# Altium project Sensor_Array.PrjPcb
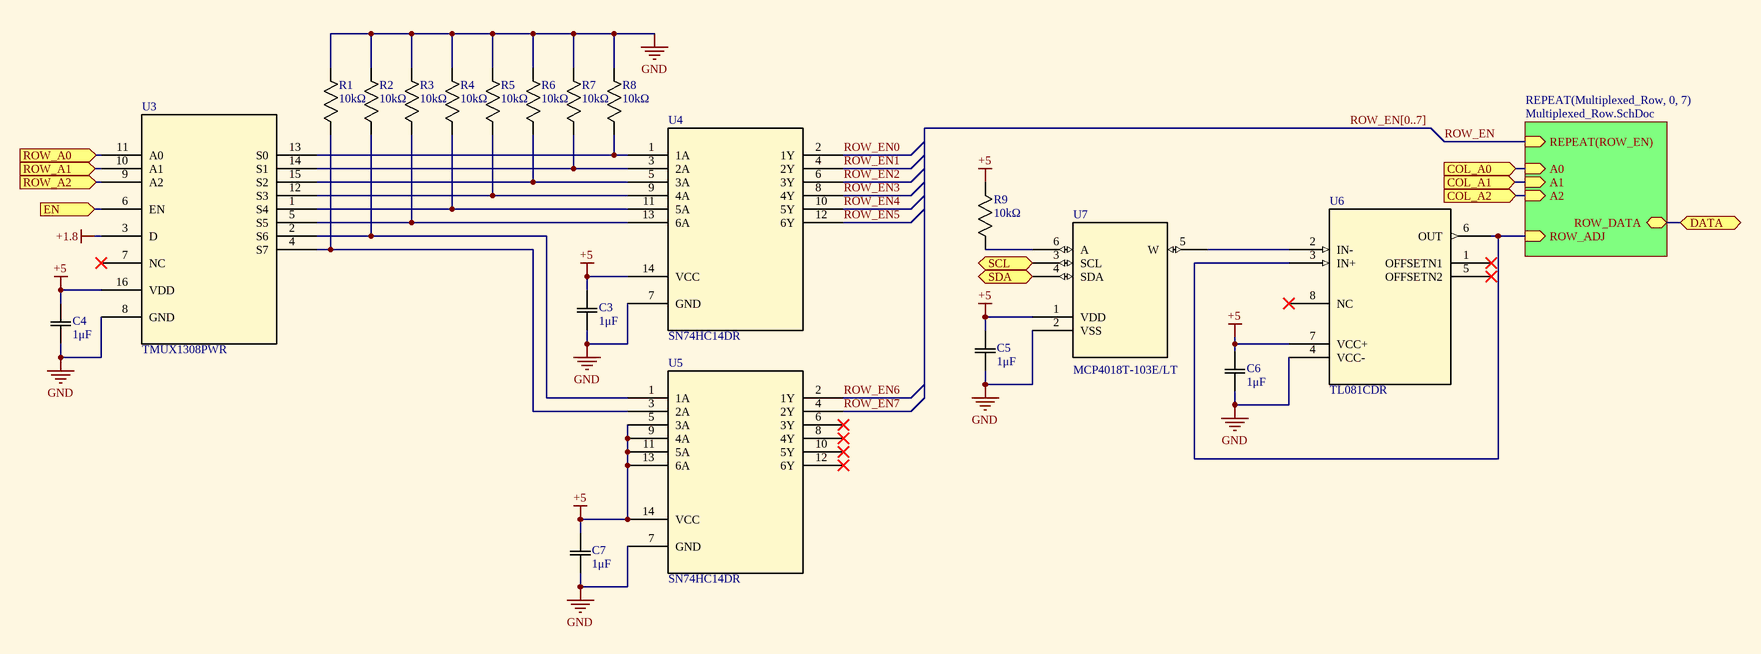
[diagram p0: TOP.SchDoc]
3 sheets, 163 parts. Net scope: hierarchical (ports join the sheet entries above them; power ports are global).
Board file: Sensor_Array.PcbDoc
Sheets:
  TOP.SchDoc
    Multiplexed_Row0 = Multiplexed_Row.SchDoc
      Hall_Latch0 = Hall_Latch.SchDoc
      Hall_Latch1 = Hall_Latch.SchDoc
      Hall_Latch2 = Hall_Latch.SchDoc
      Hall_Latch3 = Hall_Latch.SchDoc
      Hall_Latch4 = Hall_Latch.SchDoc
      Hall_Latch5 = Hall_Latch.SchDoc
      Hall_Latch6 = Hall_Latch.SchDoc
      Hall_Latch7 = Hall_Latch.SchDoc
    Multiplexed_Row1 = Multiplexed_Row.SchDoc
      Hall_Latch0 = Hall_Latch.SchDoc
      Hall_Latch1 = Hall_Latch.SchDoc
      Hall_Latch2 = Hall_Latch.SchDoc
      Hall_Latch3 = Hall_Latch.SchDoc
      Hall_Latch4 = Hall_Latch.SchDoc
      Hall_Latch5 = Hall_Latch.SchDoc
      Hall_Latch6 = Hall_Latch.SchDoc
      Hall_Latch7 = Hall_Latch.SchDoc
    Multiplexed_Row2 = Multiplexed_Row.SchDoc
      Hall_Latch0 = Hall_Latch.SchDoc
      Hall_Latch1 = Hall_Latch.SchDoc
      Hall_Latch2 = Hall_Latch.SchDoc
      Hall_Latch3 = Hall_Latch.SchDoc
      Hall_Latch4 = Hall_Latch.SchDoc
      Hall_Latch5 = Hall_Latch.SchDoc
      Hall_Latch6 = Hall_Latch.SchDoc
      Hall_Latch7 = Hall_Latch.SchDoc
    Multiplexed_Row3 = Multiplexed_Row.SchDoc
      Hall_Latch0 = Hall_Latch.SchDoc
      Hall_Latch1 = Hall_Latch.SchDoc
      Hall_Latch2 = Hall_Latch.SchDoc
      Hall_Latch3 = Hall_Latch.SchDoc
      Hall_Latch4 = Hall_Latch.SchDoc
      Hall_Latch5 = Hall_Latch.SchDoc
      Hall_Latch6 = Hall_Latch.SchDoc
      Hall_Latch7 = Hall_Latch.SchDoc
    Multiplexed_Row4 = Multiplexed_Row.SchDoc
      Hall_Latch0 = Hall_Latch.SchDoc
      Hall_Latch1 = Hall_Latch.SchDoc
      Hall_Latch2 = Hall_Latch.SchDoc
      Hall_Latch3 = Hall_Latch.SchDoc
      Hall_Latch4 = Hall_Latch.SchDoc
      Hall_Latch5 = Hall_Latch.SchDoc
      Hall_Latch6 = Hall_Latch.SchDoc
      Hall_Latch7 = Hall_Latch.SchDoc
    Multiplexed_Row5 = Multiplexed_Row.SchDoc
      Hall_Latch0 = Hall_Latch.SchDoc
      Hall_Latch1 = Hall_Latch.SchDoc
      Hall_Latch2 = Hall_Latch.SchDoc
      Hall_Latch3 = Hall_Latch.SchDoc
      Hall_Latch4 = Hall_Latch.SchDoc
      Hall_Latch5 = Hall_Latch.SchDoc
      Hall_Latch6 = Hall_Latch.SchDoc
      Hall_Latch7 = Hall_Latch.SchDoc
    Multiplexed_Row6 = Multiplexed_Row.SchDoc
      Hall_Latch0 = Hall_Latch.SchDoc
      Hall_Latch1 = Hall_Latch.SchDoc
      Hall_Latch2 = Hall_Latch.SchDoc
      Hall_Latch3 = Hall_Latch.SchDoc
      Hall_Latch4 = Hall_Latch.SchDoc
      Hall_Latch5 = Hall_Latch.SchDoc
      Hall_Latch6 = Hall_Latch.SchDoc
      Hall_Latch7 = Hall_Latch.SchDoc
    Multiplexed_Row7 = Multiplexed_Row.SchDoc
      Hall_Latch0 = Hall_Latch.SchDoc
      Hall_Latch1 = Hall_Latch.SchDoc
      Hall_Latch2 = Hall_Latch.SchDoc
      Hall_Latch3 = Hall_Latch.SchDoc
      Hall_Latch4 = Hall_Latch.SchDoc
      Hall_Latch5 = Hall_Latch.SchDoc
      Hall_Latch6 = Hall_Latch.SchDoc
      Hall_Latch7 = Hall_Latch.SchDoc

## Sheet TOP.SchDoc: Chess Board Sensor Array
size A3; DrawnBy: Brandon Skarka; Revision: 0; SheetNumber: 1; SheetTotal: 3

### Parts
C3  1μF  [CAP_CL10_SAM]
C4  1μF  [CAP_CL10_SAM]
C5  1μF  [CAP_CL10_SAM]
C6  1μF  [CAP_CL10_SAM]
C7  1μF  [CAP_CL10_SAM]
R1  10kΩ  [RES_RC0603_YAG]
R2  10kΩ  [RES_RC0603_YAG]
R3  10kΩ  [RES_RC0603_YAG]
R4  10kΩ  [RES_RC0603_YAG]
R5  10kΩ  [RES_RC0603_YAG]
R6  10kΩ  [RES_RC0603_YAG]
R7  10kΩ  [RES_RC0603_YAG]
R8  10kΩ  [RES_RC0603_YAG]
R9  10kΩ  [RES_RC0603_YAG]
U3  TMUX1308PWR  [TSSOP16_PW_TEX]
U4  SN74HC14DR  [D14]
U5  SN74HC14DR  [D14]
U6  TL081CDR  [D8]
U7  MCP4018T-103E/LT  [SC70-6_MC_MCH]

### Sub-sheets
REPEAT(Multiplexed_Row, 0, 7) = Multiplexed_Row.SchDoc: A0 (in), A1 (in), A2 (in), ROW_ADJ (in), REPEAT(ROW_EN) (in), ROW_DATA (bidir)

### Ports
COL_A0 (in), COL_A1 (in), COL_A2 (in), DATA (bidir), EN (in), ROW_A0 (in), ROW_A1 (in), ROW_A2 (in), SCL (bidir), SDA (bidir)

### Nets
+1.8: U3.3(D)
+5: C3.2 C4.2 C5.2 C6.2 C7.2 R9.2 U3.16(VDD) U4.14(VCC) U5.5(3A) U5.9(4A) U5.11(5A) U5.13(6A) U5.14(VCC) U6.7(VCC+) U7.1(VDD)
GND: C3.1 C4.1 C5.1 C6.1 C7.1 R1.2 R2.2 R3.2 R4.2 R5.2 R6.2 R7.2 R8.2 U3.8(GND) U4.7(GND) U5.7(GND) U6.4(VCC-) U7.2(VSS)
ROW_EN: sheet REPEAT(Multiplexed_Row, 0, 7)/REPEAT(ROW_EN)
ROW_EN0: U4.2(1Y)
ROW_EN1: U4.4(2Y)
ROW_EN2: U4.6(3Y)
ROW_EN3: U4.8(4Y)
ROW_EN4: U4.10(5Y)
ROW_EN5: U4.12(6Y)
ROW_EN6: U5.2(1Y)
ROW_EN7: U5.4(2Y)
NetR1_1: R1.1 U3.4(S7) U5.3(2A)
NetR2_1: R2.1 U3.2(S6) U5.1(1A)
NetR3_1: R3.1 U3.5(S5) U4.13(6A)
NetR4_1: R4.1 U3.1(S4) U4.11(5A)
NetR5_1: R5.1 U3.12(S3) U4.9(4A)
NetR6_1: R6.1 U3.15(S2) U4.5(3A)
NetR7_1: R7.1 U3.14(S1) U4.3(2A)
NetR8_1: R8.1 U3.13(S0) U4.1(1A)
NetR9_1: R9.1 U7.6(A)
NetU1_1_3: port DATA, sheet REPEAT(Multiplexed_Row, 0, 7)/ROW_DATA
NetU1_1_9: port COL_A2, sheet REPEAT(Multiplexed_Row, 0, 7)/A2
NetU1_1_10: port COL_A1, sheet REPEAT(Multiplexed_Row, 0, 7)/A1
NetU1_1_11: port COL_A0, sheet REPEAT(Multiplexed_Row, 0, 7)/A0
NetU2_1_3: U6.3(IN+) U6.6(OUT) ; sheet REPEAT(Multiplexed_Row, 0, 7)/ROW_ADJ
NetU3_6: U3.6(EN) ; port EN
NetU3_9: U3.9(A2) ; port ROW_A2
NetU3_10: U3.10(A1) ; port ROW_A1
NetU3_11: U3.11(A0) ; port ROW_A0
NetU6_2: U6.2(IN-) U7.5(W)
NetU7_3: U7.3(SCL) ; port SCL
NetU7_4: U7.4(SDA) ; port SDA

Not connected (* = marked no-connect by the designer): U3 7(NC)*; U5 6(3Y)* 8(4Y)* 10(5Y)* 12(6Y)*; U6 1(OFFSETN1)* 5(OFFSETN2)* 8(NC)*

### Buses and harness runs
bus ROW_EN[0..7]

### Library data of the parts
C3-C7 = CL10B104KB8NNWC: No Description Available; Mfr_Name: Samsung; Digi-Key_Part_Number_3: 1276-1935-6-ND; Digi-Key_Part_Number_2: 1276-1935-1-ND; Digi-Key_Part_Number_1: 1276-1935-2-ND; Supplier 1: Digi-Key; Supplier Part Number 1: 1276-1935-6-ND; Supplier 2: Mouser; Supplier Part Number 2: 187-CL10B104KB8NNWC
R1-R9 = RC0603FR-7W10KL: No Description Available; Mfr_Name: Yageo; Copyright: Copyright (C) 2023 Ultra Librarian. All rights reserved.; Manufacturer_Part_Number: RC0603FR-7W10KL; RefDes: RefDes; Type: DEV; Supplier 1: Mouser; Supplier Part Number 1: 603-RC0603FR-7W10KL; Supplier 2: Digi-Key; Supplier Part Number 2: 13-RC0603FR-7W10KLCT-ND
U3 = TMUX1308PWR: No Description Available; Mfr_Name: Texas Instruments; RefDes: RefDes; Type: Type; Supplier 1: Mouser; Supplier Part Number 1: 595-TMUX1308PWR; Supplier 2: Digi-Key; Supplier Part Number 2: 296-TMUX1308PWRCT-ND
U4 U5 = SN74HC14DR: No Description Available; Mfr_Name: Texas Instruments; Digi-Key_Part_Number_4: 2156-SN74HC14DR-ND; Digi-Key_Part_Number_3: 296-1194-6-ND; Digi-Key_Part_Number_1: 296-1194-1-ND; Digi-Key_Part_Number_2: 296-1194-2-ND; RefDes: RefDes; Type: Type; Supplier 1: Mouser; Supplier Part Number 1: 595-SN74HC14DR; Supplier 2: Digi-Key; Supplier Part Number 2: 296-1194-1-ND
U6 = TL081CDR: No Description Available; Mfr_Name: Texas Instruments; Copyright: Copyright (C) 2023 Ultra Librarian. All rights reserved.; Manufacturer_Part_Number: TL081CDR; RefDes: RefDes; Type: DEV; Supplier 1: Mouser; Supplier Part Number 1: 595-TL081CDR; Supplier 2: Digi-Key; Supplier Part Number 2: 296-15001-1-ND
U7 = MCP4018T-103ELT: No Description Available; Mfr_Name: Microchip; Copyright: Copyright (C) 2023 Ultra Librarian. All rights reserved.; Manufacturer_Part_Number: MCP4018T-103E/LT; RefDes: RefDes; Type: DEV; Supplier 1: Mouser; Supplier Part Number 1: 579-MCP4018T103E/LT; Supplier 2: Digi-Key; Supplier Part Number 2: MCP4018T-103E/LTCT-ND

## Sheet Multiplexed_Row.SchDoc: Multiplexed Row
size A4; DrawnBy: Brandon Skarka; Revision: 0; SheetNumber: 2; SheetTotal: 3
Used 8 times, as channels Multiplexed_Row0, Multiplexed_Row1, Multiplexed_Row2, Multiplexed_Row3, Multiplexed_Row4, Multiplexed_Row5, Multiplexed_Row6, Multiplexed_Row7. Parts and nets are listed once, with the designators drawn on the sheet.
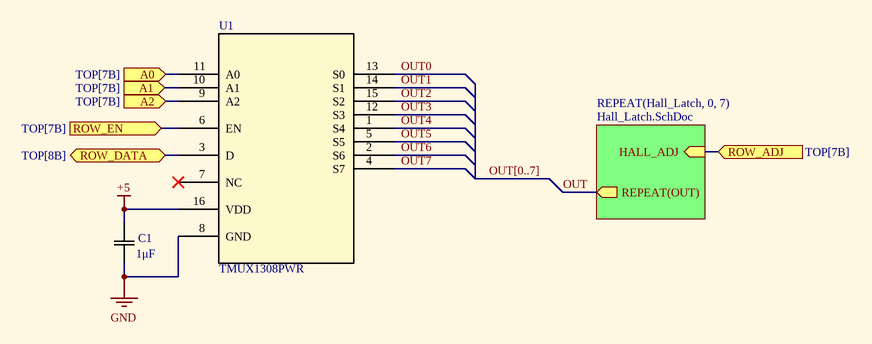
[diagram p1: Multiplexed_Row.SchDoc]

### Parts
C1  1μF  [CAP_CL10_SAM]
U1  TMUX1308PWR  [TSSOP16_PW_TEX]

### Sub-sheets
REPEAT(Hall_Latch, 0, 7) = Hall_Latch.SchDoc: REPEAT(OUT) (out), HALL_ADJ (in)

### Ports
A0 (in, see TOP[7B]), A1 (in, see TOP[7B]), A2 (in, see TOP[7B]), ROW_ADJ (in, see TOP[7B]), ROW_DATA (bidir, see TOP[8B]), ROW_EN (in, see TOP[7B])

### Nets
+5: C1.2 U1.16(VDD)
GND: C1.1 U1.8(GND)
A0: U1.11(A0) ; port A0
A1: U1.10(A1) ; port A1
A2: U1.9(A2) ; port A2
OUT: sheet REPEAT(Hall_Latch, 0, 7)/REPEAT(OUT)
OUT0: U1.13(S0)
OUT1: U1.14(S1)
OUT2: U1.15(S2)
OUT3: U1.12(S3)
OUT4: U1.1(S4)
OUT5: U1.5(S5)
OUT6: U1.2(S6)
OUT7: U1.4(S7)
ROW_ADJ: port ROW_ADJ, sheet REPEAT(Hall_Latch, 0, 7)/HALL_ADJ
ROW_DATA: U1.3(D) ; port ROW_DATA
ROW_EN: U1.6(EN) ; port ROW_EN

Not connected (* = marked no-connect by the designer): U1 7(NC)*

### Channels
Multiplexed_Row0: designators end in _1; ports A0=NetU1_1_11 A1=NetU1_1_10 A2=NetU1_1_9 ROW_ADJ=NetU2_1_3 ROW_DATA=NetU1_1_3 ROW_EN=ROW_EN0
Multiplexed_Row1: designators end in _2; ports A0=NetU1_1_11 A1=NetU1_1_10 A2=NetU1_1_9 ROW_ADJ=NetU2_1_3 ROW_DATA=NetU1_1_3 ROW_EN=ROW_EN1
Multiplexed_Row2: designators end in _3; ports A0=NetU1_1_11 A1=NetU1_1_10 A2=NetU1_1_9 ROW_ADJ=NetU2_1_3 ROW_DATA=NetU1_1_3 ROW_EN=ROW_EN2
Multiplexed_Row3: designators end in _4; ports A0=NetU1_1_11 A1=NetU1_1_10 A2=NetU1_1_9 ROW_ADJ=NetU2_1_3 ROW_DATA=NetU1_1_3 ROW_EN=ROW_EN3
Multiplexed_Row4: designators end in _5; ports A0=NetU1_1_11 A1=NetU1_1_10 A2=NetU1_1_9 ROW_ADJ=NetU2_1_3 ROW_DATA=NetU1_1_3 ROW_EN=ROW_EN4
Multiplexed_Row5: designators end in _6; ports A0=NetU1_1_11 A1=NetU1_1_10 A2=NetU1_1_9 ROW_ADJ=NetU2_1_3 ROW_DATA=NetU1_1_3 ROW_EN=ROW_EN5
Multiplexed_Row6: designators end in _7; ports A0=NetU1_1_11 A1=NetU1_1_10 A2=NetU1_1_9 ROW_ADJ=NetU2_1_3 ROW_DATA=NetU1_1_3 ROW_EN=ROW_EN6
Multiplexed_Row7: designators end in _8; ports A0=NetU1_1_11 A1=NetU1_1_10 A2=NetU1_1_9 ROW_ADJ=NetU2_1_3 ROW_DATA=NetU1_1_3 ROW_EN=ROW_EN7

### Buses and harness runs
bus OUT[0..7]

### Library data of the parts
C1 = CL10B104KB8NNWC: as C3 on sheet TOP; Digi-Key_Part_Number_3: 1276-1935-6-ND; Digi-Key_Part_Number_2: 1276-1935-1-ND; Digi-Key_Part_Number_1: 1276-1935-2-ND; Supplier 1: Digi-Key; Supplier Part Number 1: 1276-1935-6-ND; Supplier 2: Mouser; Supplier Part Number 2: 187-CL10B104KB8NNWC
U1 = TMUX1308PWR: as U3 on sheet TOP; RefDes: RefDes; Type: Type; Supplier 1: Mouser; Supplier Part Number 1: 595-TMUX1308PWR; Supplier 2: Digi-Key; Supplier Part Number 2: 296-TMUX1308PWRCT-ND

## Sheet Hall_Latch.SchDoc: Hall Sensor
size A4; DrawnBy: Brandon Skarka; Revision: 0; SheetNumber: 2; SheetTotal: 2
Used 64 times, as channels Multiplexed_Row0/Hall_Latch0, Multiplexed_Row0/Hall_Latch1, Multiplexed_Row0/Hall_Latch2, Multiplexed_Row0/Hall_Latch3, Multiplexed_Row0/Hall_Latch4, Multiplexed_Row0/Hall_Latch5, Multiplexed_Row0/Hall_Latch6, Multiplexed_Row0/Hall_Latch7, Multiplexed_Row1/Hall_Latch0, Multiplexed_Row1/Hall_Latch1, Multiplexed_Row1/Hall_Latch2, Multiplexed_Row1/Hall_Latch3, Multiplexed_Row1/Hall_Latch4, Multiplexed_Row1/Hall_Latch5, Multiplexed_Row1/Hall_Latch6, Multiplexed_Row1/Hall_Latch7, Multiplexed_Row2/Hall_Latch0, Multiplexed_Row2/Hall_Latch1, Multiplexed_Row2/Hall_Latch2, Multiplexed_Row2/Hall_Latch3, Multiplexed_Row2/Hall_Latch4, Multiplexed_Row2/Hall_Latch5, Multiplexed_Row2/Hall_Latch6, Multiplexed_Row2/Hall_Latch7, Multiplexed_Row3/Hall_Latch0, Multiplexed_Row3/Hall_Latch1, Multiplexed_Row3/Hall_Latch2, Multiplexed_Row3/Hall_Latch3, Multiplexed_Row3/Hall_Latch4, Multiplexed_Row3/Hall_Latch5, Multiplexed_Row3/Hall_Latch6, Multiplexed_Row3/Hall_Latch7, Multiplexed_Row4/Hall_Latch0, Multiplexed_Row4/Hall_Latch1, Multiplexed_Row4/Hall_Latch2, Multiplexed_Row4/Hall_Latch3, Multiplexed_Row4/Hall_Latch4, Multiplexed_Row4/Hall_Latch5, Multiplexed_Row4/Hall_Latch6, Multiplexed_Row4/Hall_Latch7, Multiplexed_Row5/Hall_Latch0, Multiplexed_Row5/Hall_Latch1, Multiplexed_Row5/Hall_Latch2, Multiplexed_Row5/Hall_Latch3, Multiplexed_Row5/Hall_Latch4, Multiplexed_Row5/Hall_Latch5, Multiplexed_Row5/Hall_Latch6, Multiplexed_Row5/Hall_Latch7, Multiplexed_Row6/Hall_Latch0, Multiplexed_Row6/Hall_Latch1, Multiplexed_Row6/Hall_Latch2, Multiplexed_Row6/Hall_Latch3, Multiplexed_Row6/Hall_Latch4, Multiplexed_Row6/Hall_Latch5, Multiplexed_Row6/Hall_Latch6, Multiplexed_Row6/Hall_Latch7, Multiplexed_Row7/Hall_Latch0, Multiplexed_Row7/Hall_Latch1, Multiplexed_Row7/Hall_Latch2, Multiplexed_Row7/Hall_Latch3, Multiplexed_Row7/Hall_Latch4, Multiplexed_Row7/Hall_Latch5, Multiplexed_Row7/Hall_Latch6, Multiplexed_Row7/Hall_Latch7. Parts and nets are listed once, with the designators drawn on the sheet.
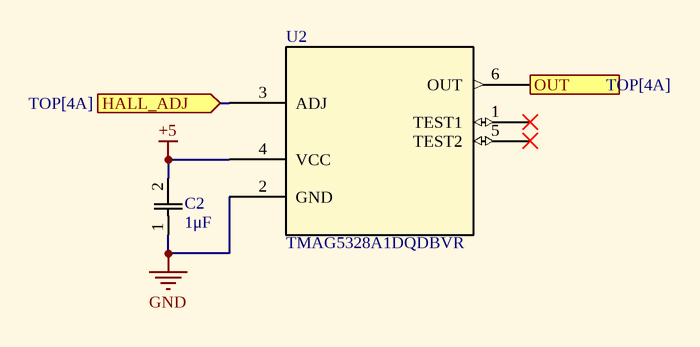
[diagram p2: Hall_Latch.SchDoc]

### Parts
C2  1μF  [CAP_CL10_SAM]
U2  TMAG5328A1DQDBVR  [SOT23_DBV_TEX]

### Ports
HALL_ADJ (in, see TOP[4A]), OUT (out, see TOP[4A])

### Nets
+5: C2.2 U2.4(VCC)
GND: C2.1 U2.2(GND)
HALL_ADJ: U2.3(ADJ) ; port HALL_ADJ
OUT: U2.6(OUT) ; port OUT

Not connected (* = marked no-connect by the designer): U2 1(TEST1)* 5(TEST2)*

### Channels
Multiplexed_Row0/Hall_Latch0: designators end in _1; ports HALL_ADJ=NetU2_1_3 OUT=OUT0_Multiplexed_Row0
Multiplexed_Row0/Hall_Latch1: designators end in _2; ports HALL_ADJ=NetU2_1_3 OUT=OUT1_Multiplexed_Row0
Multiplexed_Row0/Hall_Latch2: designators end in _3; ports HALL_ADJ=NetU2_1_3 OUT=OUT2_Multiplexed_Row0
Multiplexed_Row0/Hall_Latch3: designators end in _4; ports HALL_ADJ=NetU2_1_3 OUT=OUT3_Multiplexed_Row0
Multiplexed_Row0/Hall_Latch4: designators end in _5; ports HALL_ADJ=NetU2_1_3 OUT=OUT4_Multiplexed_Row0
Multiplexed_Row0/Hall_Latch5: designators end in _6; ports HALL_ADJ=NetU2_1_3 OUT=OUT5_Multiplexed_Row0
Multiplexed_Row0/Hall_Latch6: designators end in _7; ports HALL_ADJ=NetU2_1_3 OUT=OUT6_Multiplexed_Row0
Multiplexed_Row0/Hall_Latch7: designators end in _8; ports HALL_ADJ=NetU2_1_3 OUT=OUT7_Multiplexed_Row0
Multiplexed_Row1/Hall_Latch0: designators end in _9; ports HALL_ADJ=NetU2_1_3 OUT=OUT0_Multiplexed_Row1
Multiplexed_Row1/Hall_Latch1: designators end in _10; ports HALL_ADJ=NetU2_1_3 OUT=OUT1_Multiplexed_Row1
Multiplexed_Row1/Hall_Latch2: designators end in _11; ports HALL_ADJ=NetU2_1_3 OUT=OUT2_Multiplexed_Row1
Multiplexed_Row1/Hall_Latch3: designators end in _12; ports HALL_ADJ=NetU2_1_3 OUT=OUT3_Multiplexed_Row1
Multiplexed_Row1/Hall_Latch4: designators end in _13; ports HALL_ADJ=NetU2_1_3 OUT=OUT4_Multiplexed_Row1
Multiplexed_Row1/Hall_Latch5: designators end in _14; ports HALL_ADJ=NetU2_1_3 OUT=OUT5_Multiplexed_Row1
Multiplexed_Row1/Hall_Latch6: designators end in _15; ports HALL_ADJ=NetU2_1_3 OUT=OUT6_Multiplexed_Row1
Multiplexed_Row1/Hall_Latch7: designators end in _16; ports HALL_ADJ=NetU2_1_3 OUT=OUT7_Multiplexed_Row1
Multiplexed_Row2/Hall_Latch0: designators end in _17; ports HALL_ADJ=NetU2_1_3 OUT=OUT0_Multiplexed_Row2
Multiplexed_Row2/Hall_Latch1: designators end in _18; ports HALL_ADJ=NetU2_1_3 OUT=OUT1_Multiplexed_Row2
Multiplexed_Row2/Hall_Latch2: designators end in _19; ports HALL_ADJ=NetU2_1_3 OUT=OUT2_Multiplexed_Row2
Multiplexed_Row2/Hall_Latch3: designators end in _20; ports HALL_ADJ=NetU2_1_3 OUT=OUT3_Multiplexed_Row2
Multiplexed_Row2/Hall_Latch4: designators end in _21; ports HALL_ADJ=NetU2_1_3 OUT=OUT4_Multiplexed_Row2
Multiplexed_Row2/Hall_Latch5: designators end in _22; ports HALL_ADJ=NetU2_1_3 OUT=OUT5_Multiplexed_Row2
Multiplexed_Row2/Hall_Latch6: designators end in _23; ports HALL_ADJ=NetU2_1_3 OUT=OUT6_Multiplexed_Row2
Multiplexed_Row2/Hall_Latch7: designators end in _24; ports HALL_ADJ=NetU2_1_3 OUT=OUT7_Multiplexed_Row2
Multiplexed_Row3/Hall_Latch0: designators end in _25; ports HALL_ADJ=NetU2_1_3 OUT=OUT0_Multiplexed_Row3
Multiplexed_Row3/Hall_Latch1: designators end in _26; ports HALL_ADJ=NetU2_1_3 OUT=OUT1_Multiplexed_Row3
Multiplexed_Row3/Hall_Latch2: designators end in _27; ports HALL_ADJ=NetU2_1_3 OUT=OUT2_Multiplexed_Row3
Multiplexed_Row3/Hall_Latch3: designators end in _28; ports HALL_ADJ=NetU2_1_3 OUT=OUT3_Multiplexed_Row3
Multiplexed_Row3/Hall_Latch4: designators end in _29; ports HALL_ADJ=NetU2_1_3 OUT=OUT4_Multiplexed_Row3
Multiplexed_Row3/Hall_Latch5: designators end in _30; ports HALL_ADJ=NetU2_1_3 OUT=OUT5_Multiplexed_Row3
Multiplexed_Row3/Hall_Latch6: designators end in _31; ports HALL_ADJ=NetU2_1_3 OUT=OUT6_Multiplexed_Row3
Multiplexed_Row3/Hall_Latch7: designators end in _32; ports HALL_ADJ=NetU2_1_3 OUT=OUT7_Multiplexed_Row3
Multiplexed_Row4/Hall_Latch0: designators end in _33; ports HALL_ADJ=NetU2_1_3 OUT=OUT0_Multiplexed_Row4
Multiplexed_Row4/Hall_Latch1: designators end in _34; ports HALL_ADJ=NetU2_1_3 OUT=OUT1_Multiplexed_Row4
Multiplexed_Row4/Hall_Latch2: designators end in _35; ports HALL_ADJ=NetU2_1_3 OUT=OUT2_Multiplexed_Row4
Multiplexed_Row4/Hall_Latch3: designators end in _36; ports HALL_ADJ=NetU2_1_3 OUT=OUT3_Multiplexed_Row4
Multiplexed_Row4/Hall_Latch4: designators end in _37; ports HALL_ADJ=NetU2_1_3 OUT=OUT4_Multiplexed_Row4
Multiplexed_Row4/Hall_Latch5: designators end in _38; ports HALL_ADJ=NetU2_1_3 OUT=OUT5_Multiplexed_Row4
Multiplexed_Row4/Hall_Latch6: designators end in _39; ports HALL_ADJ=NetU2_1_3 OUT=OUT6_Multiplexed_Row4
Multiplexed_Row4/Hall_Latch7: designators end in _40; ports HALL_ADJ=NetU2_1_3 OUT=OUT7_Multiplexed_Row4
Multiplexed_Row5/Hall_Latch0: designators end in _41; ports HALL_ADJ=NetU2_1_3 OUT=OUT0_Multiplexed_Row5
Multiplexed_Row5/Hall_Latch1: designators end in _42; ports HALL_ADJ=NetU2_1_3 OUT=OUT1_Multiplexed_Row5
Multiplexed_Row5/Hall_Latch2: designators end in _43; ports HALL_ADJ=NetU2_1_3 OUT=OUT2_Multiplexed_Row5
Multiplexed_Row5/Hall_Latch3: designators end in _44; ports HALL_ADJ=NetU2_1_3 OUT=OUT3_Multiplexed_Row5
Multiplexed_Row5/Hall_Latch4: designators end in _45; ports HALL_ADJ=NetU2_1_3 OUT=OUT4_Multiplexed_Row5
Multiplexed_Row5/Hall_Latch5: designators end in _46; ports HALL_ADJ=NetU2_1_3 OUT=OUT5_Multiplexed_Row5
Multiplexed_Row5/Hall_Latch6: designators end in _47; ports HALL_ADJ=NetU2_1_3 OUT=OUT6_Multiplexed_Row5
Multiplexed_Row5/Hall_Latch7: designators end in _48; ports HALL_ADJ=NetU2_1_3 OUT=OUT7_Multiplexed_Row5
Multiplexed_Row6/Hall_Latch0: designators end in _49; ports HALL_ADJ=NetU2_1_3 OUT=OUT0_Multiplexed_Row6
Multiplexed_Row6/Hall_Latch1: designators end in _50; ports HALL_ADJ=NetU2_1_3 OUT=OUT1_Multiplexed_Row6
Multiplexed_Row6/Hall_Latch2: designators end in _51; ports HALL_ADJ=NetU2_1_3 OUT=OUT2_Multiplexed_Row6
Multiplexed_Row6/Hall_Latch3: designators end in _52; ports HALL_ADJ=NetU2_1_3 OUT=OUT3_Multiplexed_Row6
Multiplexed_Row6/Hall_Latch4: designators end in _53; ports HALL_ADJ=NetU2_1_3 OUT=OUT4_Multiplexed_Row6
Multiplexed_Row6/Hall_Latch5: designators end in _54; ports HALL_ADJ=NetU2_1_3 OUT=OUT5_Multiplexed_Row6
Multiplexed_Row6/Hall_Latch6: designators end in _55; ports HALL_ADJ=NetU2_1_3 OUT=OUT6_Multiplexed_Row6
Multiplexed_Row6/Hall_Latch7: designators end in _56; ports HALL_ADJ=NetU2_1_3 OUT=OUT7_Multiplexed_Row6
Multiplexed_Row7/Hall_Latch0: designators end in _57; ports HALL_ADJ=NetU2_1_3 OUT=OUT0_Multiplexed_Row7
Multiplexed_Row7/Hall_Latch1: designators end in _58; ports HALL_ADJ=NetU2_1_3 OUT=OUT1_Multiplexed_Row7
Multiplexed_Row7/Hall_Latch2: designators end in _59; ports HALL_ADJ=NetU2_1_3 OUT=OUT2_Multiplexed_Row7
Multiplexed_Row7/Hall_Latch3: designators end in _60; ports HALL_ADJ=NetU2_1_3 OUT=OUT3_Multiplexed_Row7
Multiplexed_Row7/Hall_Latch4: designators end in _61; ports HALL_ADJ=NetU2_1_3 OUT=OUT4_Multiplexed_Row7
Multiplexed_Row7/Hall_Latch5: designators end in _62; ports HALL_ADJ=NetU2_1_3 OUT=OUT5_Multiplexed_Row7
Multiplexed_Row7/Hall_Latch6: designators end in _63; ports HALL_ADJ=NetU2_1_3 OUT=OUT6_Multiplexed_Row7
Multiplexed_Row7/Hall_Latch7: designators end in _64; ports HALL_ADJ=NetU2_1_3 OUT=OUT7_Multiplexed_Row7

### Library data of the parts
C2 = CL10B104KB8NNWC: as C3 on sheet TOP; Digi-Key_Part_Number_3: 1276-1935-6-ND; Digi-Key_Part_Number_2: 1276-1935-1-ND; Digi-Key_Part_Number_1: 1276-1935-2-ND; Supplier 1: Digi-Key; Supplier Part Number 1: 1276-1935-6-ND; Supplier 2: Mouser; Supplier Part Number 2: 187-CL10B104KB8NNWC
U2 = TMAG5328A1DQDBVR: No Description Available; Mfr_Name: Texas Instruments; Copyright: Copyright (C) 2023 Ultra Librarian. All rights reserved.; Manufacturer_Part_Number: TMAG5328A1DQDBVR; RefDes: RefDes; Type: DEV; Supplier 1: Digi-Key; Supplier Part Number 1: 296-TMAG5231A1CQDBZRCT-ND

## Nets that join several sheets
+5: TOP (15 pins), Multiplexed_Row0 (C1_1.2 U1_1.16), Multiplexed_Row0/Hall_Latch0 (C2_1.2 U2_1.4), Multiplexed_Row0/Hall_Latch1 (C2_2.2 U2_2.4), Multiplexed_Row0/Hall_Latch2 (C2_3.2 U2_3.4), Multiplexed_Row0/Hall_Latch3 (C2_4.2 U2_4.4), Multiplexed_Row0/Hall_Latch4 (C2_5.2 U2_5.4), Multiplexed_Row0/Hall_Latch5 (C2_6.2 U2_6.4), Multiplexed_Row0/Hall_Latch6 (C2_7.2 U2_7.4), Multiplexed_Row0/Hall_Latch7 (C2_8.2 U2_8.4), Multiplexed_Row1 (C1_2.2 U1_2.16), Multiplexed_Row1/Hall_Latch0 (C2_9.2 U2_9.4), Multiplexed_Row1/Hall_Latch1 (C2_10.2 U2_10.4), Multiplexed_Row1/Hall_Latch2 (C2_11.2 U2_11.4), Multiplexed_Row1/Hall_Latch3 (C2_12.2 U2_12.4), Multiplexed_Row1/Hall_Latch4 (C2_13.2 U2_13.4), Multiplexed_Row1/Hall_Latch5 (C2_14.2 U2_14.4), Multiplexed_Row1/Hall_Latch6 (C2_15.2 U2_15.4), Multiplexed_Row1/Hall_Latch7 (C2_16.2 U2_16.4), Multiplexed_Row2 (C1_3.2 U1_3.16), Multiplexed_Row2/Hall_Latch0 (C2_17.2 U2_17.4), Multiplexed_Row2/Hall_Latch1 (C2_18.2 U2_18.4), Multiplexed_Row2/Hall_Latch2 (C2_19.2 U2_19.4), Multiplexed_Row2/Hall_Latch3 (C2_20.2 U2_20.4), Multiplexed_Row2/Hall_Latch4 (C2_21.2 U2_21.4), Multiplexed_Row2/Hall_Latch5 (C2_22.2 U2_22.4), Multiplexed_Row2/Hall_Latch6 (C2_23.2 U2_23.4), Multiplexed_Row2/Hall_Latch7 (C2_24.2 U2_24.4), Multiplexed_Row3 (C1_4.2 U1_4.16), Multiplexed_Row3/Hall_Latch0 (C2_25.2 U2_25.4), Multiplexed_Row3/Hall_Latch1 (C2_26.2 U2_26.4), Multiplexed_Row3/Hall_Latch2 (C2_27.2 U2_27.4), Multiplexed_Row3/Hall_Latch3 (C2_28.2 U2_28.4), Multiplexed_Row3/Hall_Latch4 (C2_29.2 U2_29.4), Multiplexed_Row3/Hall_Latch5 (C2_30.2 U2_30.4), Multiplexed_Row3/Hall_Latch6 (C2_31.2 U2_31.4), Multiplexed_Row3/Hall_Latch7 (C2_32.2 U2_32.4), Multiplexed_Row4 (C1_5.2 U1_5.16), Multiplexed_Row4/Hall_Latch0 (C2_33.2 U2_33.4), Multiplexed_Row4/Hall_Latch1 (C2_34.2 U2_34.4), Multiplexed_Row4/Hall_Latch2 (C2_35.2 U2_35.4), Multiplexed_Row4/Hall_Latch3 (C2_36.2 U2_36.4), Multiplexed_Row4/Hall_Latch4 (C2_37.2 U2_37.4), Multiplexed_Row4/Hall_Latch5 (C2_38.2 U2_38.4), Multiplexed_Row4/Hall_Latch6 (C2_39.2 U2_39.4), Multiplexed_Row4/Hall_Latch7 (C2_40.2 U2_40.4), Multiplexed_Row5 (C1_6.2 U1_6.16), Multiplexed_Row5/Hall_Latch0 (C2_41.2 U2_41.4), Multiplexed_Row5/Hall_Latch1 (C2_42.2 U2_42.4), Multiplexed_Row5/Hall_Latch2 (C2_43.2 U2_43.4), Multiplexed_Row5/Hall_Latch3 (C2_44.2 U2_44.4), Multiplexed_Row5/Hall_Latch4 (C2_45.2 U2_45.4), Multiplexed_Row5/Hall_Latch5 (C2_46.2 U2_46.4), Multiplexed_Row5/Hall_Latch6 (C2_47.2 U2_47.4), Multiplexed_Row5/Hall_Latch7 (C2_48.2 U2_48.4), Multiplexed_Row6 (C1_7.2 U1_7.16), Multiplexed_Row6/Hall_Latch0 (C2_49.2 U2_49.4), Multiplexed_Row6/Hall_Latch1 (C2_50.2 U2_50.4), Multiplexed_Row6/Hall_Latch2 (C2_51.2 U2_51.4), Multiplexed_Row6/Hall_Latch3 (C2_52.2 U2_52.4), Multiplexed_Row6/Hall_Latch4 (C2_53.2 U2_53.4), Multiplexed_Row6/Hall_Latch5 (C2_54.2 U2_54.4), Multiplexed_Row6/Hall_Latch6 (C2_55.2 U2_55.4), Multiplexed_Row6/Hall_Latch7 (C2_56.2 U2_56.4), Multiplexed_Row7 (C1_8.2 U1_8.16), Multiplexed_Row7/Hall_Latch0 (C2_57.2 U2_57.4), Multiplexed_Row7/Hall_Latch1 (C2_58.2 U2_58.4), Multiplexed_Row7/Hall_Latch2 (C2_59.2 U2_59.4), Multiplexed_Row7/Hall_Latch3 (C2_60.2 U2_60.4), Multiplexed_Row7/Hall_Latch4 (C2_61.2 U2_61.4), Multiplexed_Row7/Hall_Latch5 (C2_62.2 U2_62.4), Multiplexed_Row7/Hall_Latch6 (C2_63.2 U2_63.4), Multiplexed_Row7/Hall_Latch7 (C2_64.2 U2_64.4)
GND: TOP (18 pins), Multiplexed_Row0 (C1_1.1 U1_1.8), Multiplexed_Row0/Hall_Latch0 (C2_1.1 U2_1.2), Multiplexed_Row0/Hall_Latch1 (C2_2.1 U2_2.2), Multiplexed_Row0/Hall_Latch2 (C2_3.1 U2_3.2), Multiplexed_Row0/Hall_Latch3 (C2_4.1 U2_4.2), Multiplexed_Row0/Hall_Latch4 (C2_5.1 U2_5.2), Multiplexed_Row0/Hall_Latch5 (C2_6.1 U2_6.2), Multiplexed_Row0/Hall_Latch6 (C2_7.1 U2_7.2), Multiplexed_Row0/Hall_Latch7 (C2_8.1 U2_8.2), Multiplexed_Row1 (C1_2.1 U1_2.8), Multiplexed_Row1/Hall_Latch0 (C2_9.1 U2_9.2), Multiplexed_Row1/Hall_Latch1 (C2_10.1 U2_10.2), Multiplexed_Row1/Hall_Latch2 (C2_11.1 U2_11.2), Multiplexed_Row1/Hall_Latch3 (C2_12.1 U2_12.2), Multiplexed_Row1/Hall_Latch4 (C2_13.1 U2_13.2), Multiplexed_Row1/Hall_Latch5 (C2_14.1 U2_14.2), Multiplexed_Row1/Hall_Latch6 (C2_15.1 U2_15.2), Multiplexed_Row1/Hall_Latch7 (C2_16.1 U2_16.2), Multiplexed_Row2 (C1_3.1 U1_3.8), Multiplexed_Row2/Hall_Latch0 (C2_17.1 U2_17.2), Multiplexed_Row2/Hall_Latch1 (C2_18.1 U2_18.2), Multiplexed_Row2/Hall_Latch2 (C2_19.1 U2_19.2), Multiplexed_Row2/Hall_Latch3 (C2_20.1 U2_20.2), Multiplexed_Row2/Hall_Latch4 (C2_21.1 U2_21.2), Multiplexed_Row2/Hall_Latch5 (C2_22.1 U2_22.2), Multiplexed_Row2/Hall_Latch6 (C2_23.1 U2_23.2), Multiplexed_Row2/Hall_Latch7 (C2_24.1 U2_24.2), Multiplexed_Row3 (C1_4.1 U1_4.8), Multiplexed_Row3/Hall_Latch0 (C2_25.1 U2_25.2), Multiplexed_Row3/Hall_Latch1 (C2_26.1 U2_26.2), Multiplexed_Row3/Hall_Latch2 (C2_27.1 U2_27.2), Multiplexed_Row3/Hall_Latch3 (C2_28.1 U2_28.2), Multiplexed_Row3/Hall_Latch4 (C2_29.1 U2_29.2), Multiplexed_Row3/Hall_Latch5 (C2_30.1 U2_30.2), Multiplexed_Row3/Hall_Latch6 (C2_31.1 U2_31.2), Multiplexed_Row3/Hall_Latch7 (C2_32.1 U2_32.2), Multiplexed_Row4 (C1_5.1 U1_5.8), Multiplexed_Row4/Hall_Latch0 (C2_33.1 U2_33.2), Multiplexed_Row4/Hall_Latch1 (C2_34.1 U2_34.2), Multiplexed_Row4/Hall_Latch2 (C2_35.1 U2_35.2), Multiplexed_Row4/Hall_Latch3 (C2_36.1 U2_36.2), Multiplexed_Row4/Hall_Latch4 (C2_37.1 U2_37.2), Multiplexed_Row4/Hall_Latch5 (C2_38.1 U2_38.2), Multiplexed_Row4/Hall_Latch6 (C2_39.1 U2_39.2), Multiplexed_Row4/Hall_Latch7 (C2_40.1 U2_40.2), Multiplexed_Row5 (C1_6.1 U1_6.8), Multiplexed_Row5/Hall_Latch0 (C2_41.1 U2_41.2), Multiplexed_Row5/Hall_Latch1 (C2_42.1 U2_42.2), Multiplexed_Row5/Hall_Latch2 (C2_43.1 U2_43.2), Multiplexed_Row5/Hall_Latch3 (C2_44.1 U2_44.2), Multiplexed_Row5/Hall_Latch4 (C2_45.1 U2_45.2), Multiplexed_Row5/Hall_Latch5 (C2_46.1 U2_46.2), Multiplexed_Row5/Hall_Latch6 (C2_47.1 U2_47.2), Multiplexed_Row5/Hall_Latch7 (C2_48.1 U2_48.2), Multiplexed_Row6 (C1_7.1 U1_7.8), Multiplexed_Row6/Hall_Latch0 (C2_49.1 U2_49.2), Multiplexed_Row6/Hall_Latch1 (C2_50.1 U2_50.2), Multiplexed_Row6/Hall_Latch2 (C2_51.1 U2_51.2), Multiplexed_Row6/Hall_Latch3 (C2_52.1 U2_52.2), Multiplexed_Row6/Hall_Latch4 (C2_53.1 U2_53.2), Multiplexed_Row6/Hall_Latch5 (C2_54.1 U2_54.2), Multiplexed_Row6/Hall_Latch6 (C2_55.1 U2_55.2), Multiplexed_Row6/Hall_Latch7 (C2_56.1 U2_56.2), Multiplexed_Row7 (C1_8.1 U1_8.8), Multiplexed_Row7/Hall_Latch0 (C2_57.1 U2_57.2), Multiplexed_Row7/Hall_Latch1 (C2_58.1 U2_58.2), Multiplexed_Row7/Hall_Latch2 (C2_59.1 U2_59.2), Multiplexed_Row7/Hall_Latch3 (C2_60.1 U2_60.2), Multiplexed_Row7/Hall_Latch4 (C2_61.1 U2_61.2), Multiplexed_Row7/Hall_Latch5 (C2_62.1 U2_62.2), Multiplexed_Row7/Hall_Latch6 (C2_63.1 U2_63.2), Multiplexed_Row7/Hall_Latch7 (C2_64.1 U2_64.2)
NetU1_1_3: Multiplexed_Row0 (U1_1.3), Multiplexed_Row1 (U1_2.3), Multiplexed_Row2 (U1_3.3), Multiplexed_Row3 (U1_4.3), Multiplexed_Row4 (U1_5.3), Multiplexed_Row5 (U1_6.3), Multiplexed_Row6 (U1_7.3), Multiplexed_Row7 (U1_8.3)
NetU1_1_9: Multiplexed_Row0 (U1_1.9), Multiplexed_Row1 (U1_2.9), Multiplexed_Row2 (U1_3.9), Multiplexed_Row3 (U1_4.9), Multiplexed_Row4 (U1_5.9), Multiplexed_Row5 (U1_6.9), Multiplexed_Row6 (U1_7.9), Multiplexed_Row7 (U1_8.9)
NetU1_1_10: Multiplexed_Row0 (U1_1.10), Multiplexed_Row1 (U1_2.10), Multiplexed_Row2 (U1_3.10), Multiplexed_Row3 (U1_4.10), Multiplexed_Row4 (U1_5.10), Multiplexed_Row5 (U1_6.10), Multiplexed_Row6 (U1_7.10), Multiplexed_Row7 (U1_8.10)
NetU1_1_11: Multiplexed_Row0 (U1_1.11), Multiplexed_Row1 (U1_2.11), Multiplexed_Row2 (U1_3.11), Multiplexed_Row3 (U1_4.11), Multiplexed_Row4 (U1_5.11), Multiplexed_Row5 (U1_6.11), Multiplexed_Row6 (U1_7.11), Multiplexed_Row7 (U1_8.11)
NetU2_1_3: TOP (U6.3 U6.6), Multiplexed_Row0/Hall_Latch0 (U2_1.3), Multiplexed_Row0/Hall_Latch1 (U2_2.3), Multiplexed_Row0/Hall_Latch2 (U2_3.3), Multiplexed_Row0/Hall_Latch3 (U2_4.3), Multiplexed_Row0/Hall_Latch4 (U2_5.3), Multiplexed_Row0/Hall_Latch5 (U2_6.3), Multiplexed_Row0/Hall_Latch6 (U2_7.3), Multiplexed_Row0/Hall_Latch7 (U2_8.3), Multiplexed_Row1/Hall_Latch0 (U2_9.3), Multiplexed_Row1/Hall_Latch1 (U2_10.3), Multiplexed_Row1/Hall_Latch2 (U2_11.3), Multiplexed_Row1/Hall_Latch3 (U2_12.3), Multiplexed_Row1/Hall_Latch4 (U2_13.3), Multiplexed_Row1/Hall_Latch5 (U2_14.3), Multiplexed_Row1/Hall_Latch6 (U2_15.3), Multiplexed_Row1/Hall_Latch7 (U2_16.3), Multiplexed_Row2/Hall_Latch0 (U2_17.3), Multiplexed_Row2/Hall_Latch1 (U2_18.3), Multiplexed_Row2/Hall_Latch2 (U2_19.3), Multiplexed_Row2/Hall_Latch3 (U2_20.3), Multiplexed_Row2/Hall_Latch4 (U2_21.3), Multiplexed_Row2/Hall_Latch5 (U2_22.3), Multiplexed_Row2/Hall_Latch6 (U2_23.3), Multiplexed_Row2/Hall_Latch7 (U2_24.3), Multiplexed_Row3/Hall_Latch0 (U2_25.3), Multiplexed_Row3/Hall_Latch1 (U2_26.3), Multiplexed_Row3/Hall_Latch2 (U2_27.3), Multiplexed_Row3/Hall_Latch3 (U2_28.3), Multiplexed_Row3/Hall_Latch4 (U2_29.3), Multiplexed_Row3/Hall_Latch5 (U2_30.3), Multiplexed_Row3/Hall_Latch6 (U2_31.3), Multiplexed_Row3/Hall_Latch7 (U2_32.3), Multiplexed_Row4/Hall_Latch0 (U2_33.3), Multiplexed_Row4/Hall_Latch1 (U2_34.3), Multiplexed_Row4/Hall_Latch2 (U2_35.3), Multiplexed_Row4/Hall_Latch3 (U2_36.3), Multiplexed_Row4/Hall_Latch4 (U2_37.3), Multiplexed_Row4/Hall_Latch5 (U2_38.3), Multiplexed_Row4/Hall_Latch6 (U2_39.3), Multiplexed_Row4/Hall_Latch7 (U2_40.3), Multiplexed_Row5/Hall_Latch0 (U2_41.3), Multiplexed_Row5/Hall_Latch1 (U2_42.3), Multiplexed_Row5/Hall_Latch2 (U2_43.3), Multiplexed_Row5/Hall_Latch3 (U2_44.3), Multiplexed_Row5/Hall_Latch4 (U2_45.3), Multiplexed_Row5/Hall_Latch5 (U2_46.3), Multiplexed_Row5/Hall_Latch6 (U2_47.3), Multiplexed_Row5/Hall_Latch7 (U2_48.3), Multiplexed_Row6/Hall_Latch0 (U2_49.3), Multiplexed_Row6/Hall_Latch1 (U2_50.3), Multiplexed_Row6/Hall_Latch2 (U2_51.3), Multiplexed_Row6/Hall_Latch3 (U2_52.3), Multiplexed_Row6/Hall_Latch4 (U2_53.3), Multiplexed_Row6/Hall_Latch5 (U2_54.3), Multiplexed_Row6/Hall_Latch6 (U2_55.3), Multiplexed_Row6/Hall_Latch7 (U2_56.3), Multiplexed_Row7/Hall_Latch0 (U2_57.3), Multiplexed_Row7/Hall_Latch1 (U2_58.3), Multiplexed_Row7/Hall_Latch2 (U2_59.3), Multiplexed_Row7/Hall_Latch3 (U2_60.3), Multiplexed_Row7/Hall_Latch4 (U2_61.3), Multiplexed_Row7/Hall_Latch5 (U2_62.3), Multiplexed_Row7/Hall_Latch6 (U2_63.3), Multiplexed_Row7/Hall_Latch7 (U2_64.3)
OUT0_Multiplexed_Row0: Multiplexed_Row0 (U1_1.13), Multiplexed_Row0/Hall_Latch0 (U2_1.6)
OUT0_Multiplexed_Row1: Multiplexed_Row1 (U1_2.13), Multiplexed_Row1/Hall_Latch0 (U2_9.6)
OUT0_Multiplexed_Row2: Multiplexed_Row2 (U1_3.13), Multiplexed_Row2/Hall_Latch0 (U2_17.6)
OUT0_Multiplexed_Row3: Multiplexed_Row3 (U1_4.13), Multiplexed_Row3/Hall_Latch0 (U2_25.6)
OUT0_Multiplexed_Row4: Multiplexed_Row4 (U1_5.13), Multiplexed_Row4/Hall_Latch0 (U2_33.6)
OUT0_Multiplexed_Row5: Multiplexed_Row5 (U1_6.13), Multiplexed_Row5/Hall_Latch0 (U2_41.6)
OUT0_Multiplexed_Row6: Multiplexed_Row6 (U1_7.13), Multiplexed_Row6/Hall_Latch0 (U2_49.6)
OUT0_Multiplexed_Row7: Multiplexed_Row7 (U1_8.13), Multiplexed_Row7/Hall_Latch0 (U2_57.6)
OUT1_Multiplexed_Row0: Multiplexed_Row0 (U1_1.14), Multiplexed_Row0/Hall_Latch1 (U2_2.6)
OUT1_Multiplexed_Row1: Multiplexed_Row1 (U1_2.14), Multiplexed_Row1/Hall_Latch1 (U2_10.6)
OUT1_Multiplexed_Row2: Multiplexed_Row2 (U1_3.14), Multiplexed_Row2/Hall_Latch1 (U2_18.6)
OUT1_Multiplexed_Row3: Multiplexed_Row3 (U1_4.14), Multiplexed_Row3/Hall_Latch1 (U2_26.6)
OUT1_Multiplexed_Row4: Multiplexed_Row4 (U1_5.14), Multiplexed_Row4/Hall_Latch1 (U2_34.6)
OUT1_Multiplexed_Row5: Multiplexed_Row5 (U1_6.14), Multiplexed_Row5/Hall_Latch1 (U2_42.6)
OUT1_Multiplexed_Row6: Multiplexed_Row6 (U1_7.14), Multiplexed_Row6/Hall_Latch1 (U2_50.6)
OUT1_Multiplexed_Row7: Multiplexed_Row7 (U1_8.14), Multiplexed_Row7/Hall_Latch1 (U2_58.6)
OUT2_Multiplexed_Row0: Multiplexed_Row0 (U1_1.15), Multiplexed_Row0/Hall_Latch2 (U2_3.6)
OUT2_Multiplexed_Row1: Multiplexed_Row1 (U1_2.15), Multiplexed_Row1/Hall_Latch2 (U2_11.6)
OUT2_Multiplexed_Row2: Multiplexed_Row2 (U1_3.15), Multiplexed_Row2/Hall_Latch2 (U2_19.6)
OUT2_Multiplexed_Row3: Multiplexed_Row3 (U1_4.15), Multiplexed_Row3/Hall_Latch2 (U2_27.6)
OUT2_Multiplexed_Row4: Multiplexed_Row4 (U1_5.15), Multiplexed_Row4/Hall_Latch2 (U2_35.6)
OUT2_Multiplexed_Row5: Multiplexed_Row5 (U1_6.15), Multiplexed_Row5/Hall_Latch2 (U2_43.6)
OUT2_Multiplexed_Row6: Multiplexed_Row6 (U1_7.15), Multiplexed_Row6/Hall_Latch2 (U2_51.6)
OUT2_Multiplexed_Row7: Multiplexed_Row7 (U1_8.15), Multiplexed_Row7/Hall_Latch2 (U2_59.6)
OUT3_Multiplexed_Row0: Multiplexed_Row0 (U1_1.12), Multiplexed_Row0/Hall_Latch3 (U2_4.6)
OUT3_Multiplexed_Row1: Multiplexed_Row1 (U1_2.12), Multiplexed_Row1/Hall_Latch3 (U2_12.6)
OUT3_Multiplexed_Row2: Multiplexed_Row2 (U1_3.12), Multiplexed_Row2/Hall_Latch3 (U2_20.6)
OUT3_Multiplexed_Row3: Multiplexed_Row3 (U1_4.12), Multiplexed_Row3/Hall_Latch3 (U2_28.6)
OUT3_Multiplexed_Row4: Multiplexed_Row4 (U1_5.12), Multiplexed_Row4/Hall_Latch3 (U2_36.6)
OUT3_Multiplexed_Row5: Multiplexed_Row5 (U1_6.12), Multiplexed_Row5/Hall_Latch3 (U2_44.6)
OUT3_Multiplexed_Row6: Multiplexed_Row6 (U1_7.12), Multiplexed_Row6/Hall_Latch3 (U2_52.6)
OUT3_Multiplexed_Row7: Multiplexed_Row7 (U1_8.12), Multiplexed_Row7/Hall_Latch3 (U2_60.6)
OUT4_Multiplexed_Row0: Multiplexed_Row0 (U1_1.1), Multiplexed_Row0/Hall_Latch4 (U2_5.6)
OUT4_Multiplexed_Row1: Multiplexed_Row1 (U1_2.1), Multiplexed_Row1/Hall_Latch4 (U2_13.6)
OUT4_Multiplexed_Row2: Multiplexed_Row2 (U1_3.1), Multiplexed_Row2/Hall_Latch4 (U2_21.6)
OUT4_Multiplexed_Row3: Multiplexed_Row3 (U1_4.1), Multiplexed_Row3/Hall_Latch4 (U2_29.6)
OUT4_Multiplexed_Row4: Multiplexed_Row4 (U1_5.1), Multiplexed_Row4/Hall_Latch4 (U2_37.6)
OUT4_Multiplexed_Row5: Multiplexed_Row5 (U1_6.1), Multiplexed_Row5/Hall_Latch4 (U2_45.6)
OUT4_Multiplexed_Row6: Multiplexed_Row6 (U1_7.1), Multiplexed_Row6/Hall_Latch4 (U2_53.6)
OUT4_Multiplexed_Row7: Multiplexed_Row7 (U1_8.1), Multiplexed_Row7/Hall_Latch4 (U2_61.6)
OUT5_Multiplexed_Row0: Multiplexed_Row0 (U1_1.5), Multiplexed_Row0/Hall_Latch5 (U2_6.6)
OUT5_Multiplexed_Row1: Multiplexed_Row1 (U1_2.5), Multiplexed_Row1/Hall_Latch5 (U2_14.6)
OUT5_Multiplexed_Row2: Multiplexed_Row2 (U1_3.5), Multiplexed_Row2/Hall_Latch5 (U2_22.6)
OUT5_Multiplexed_Row3: Multiplexed_Row3 (U1_4.5), Multiplexed_Row3/Hall_Latch5 (U2_30.6)
OUT5_Multiplexed_Row4: Multiplexed_Row4 (U1_5.5), Multiplexed_Row4/Hall_Latch5 (U2_38.6)
OUT5_Multiplexed_Row5: Multiplexed_Row5 (U1_6.5), Multiplexed_Row5/Hall_Latch5 (U2_46.6)
OUT5_Multiplexed_Row6: Multiplexed_Row6 (U1_7.5), Multiplexed_Row6/Hall_Latch5 (U2_54.6)
OUT5_Multiplexed_Row7: Multiplexed_Row7 (U1_8.5), Multiplexed_Row7/Hall_Latch5 (U2_62.6)
OUT6_Multiplexed_Row0: Multiplexed_Row0 (U1_1.2), Multiplexed_Row0/Hall_Latch6 (U2_7.6)
OUT6_Multiplexed_Row1: Multiplexed_Row1 (U1_2.2), Multiplexed_Row1/Hall_Latch6 (U2_15.6)
OUT6_Multiplexed_Row2: Multiplexed_Row2 (U1_3.2), Multiplexed_Row2/Hall_Latch6 (U2_23.6)
OUT6_Multiplexed_Row3: Multiplexed_Row3 (U1_4.2), Multiplexed_Row3/Hall_Latch6 (U2_31.6)
OUT6_Multiplexed_Row4: Multiplexed_Row4 (U1_5.2), Multiplexed_Row4/Hall_Latch6 (U2_39.6)
OUT6_Multiplexed_Row5: Multiplexed_Row5 (U1_6.2), Multiplexed_Row5/Hall_Latch6 (U2_47.6)
OUT6_Multiplexed_Row6: Multiplexed_Row6 (U1_7.2), Multiplexed_Row6/Hall_Latch6 (U2_55.6)
OUT6_Multiplexed_Row7: Multiplexed_Row7 (U1_8.2), Multiplexed_Row7/Hall_Latch6 (U2_63.6)
OUT7_Multiplexed_Row0: Multiplexed_Row0 (U1_1.4), Multiplexed_Row0/Hall_Latch7 (U2_8.6)
OUT7_Multiplexed_Row1: Multiplexed_Row1 (U1_2.4), Multiplexed_Row1/Hall_Latch7 (U2_16.6)
OUT7_Multiplexed_Row2: Multiplexed_Row2 (U1_3.4), Multiplexed_Row2/Hall_Latch7 (U2_24.6)
OUT7_Multiplexed_Row3: Multiplexed_Row3 (U1_4.4), Multiplexed_Row3/Hall_Latch7 (U2_32.6)
OUT7_Multiplexed_Row4: Multiplexed_Row4 (U1_5.4), Multiplexed_Row4/Hall_Latch7 (U2_40.6)
OUT7_Multiplexed_Row5: Multiplexed_Row5 (U1_6.4), Multiplexed_Row5/Hall_Latch7 (U2_48.6)
OUT7_Multiplexed_Row6: Multiplexed_Row6 (U1_7.4), Multiplexed_Row6/Hall_Latch7 (U2_56.6)
OUT7_Multiplexed_Row7: Multiplexed_Row7 (U1_8.4), Multiplexed_Row7/Hall_Latch7 (U2_64.6)
ROW_EN0: TOP (U4.2), Multiplexed_Row0 (U1_1.6)
ROW_EN1: TOP (U4.4), Multiplexed_Row1 (U1_2.6)
ROW_EN2: TOP (U4.6), Multiplexed_Row2 (U1_3.6)
ROW_EN3: TOP (U4.8), Multiplexed_Row3 (U1_4.6)
ROW_EN4: TOP (U4.10), Multiplexed_Row4 (U1_5.6)
ROW_EN5: TOP (U4.12), Multiplexed_Row5 (U1_6.6)
ROW_EN6: TOP (U5.2), Multiplexed_Row6 (U1_7.6)
ROW_EN7: TOP (U5.4), Multiplexed_Row7 (U1_8.6)